# EAGLE design toro10kicker (EAGLE 7.7.0)

## Sheet 1 of 3: Controller
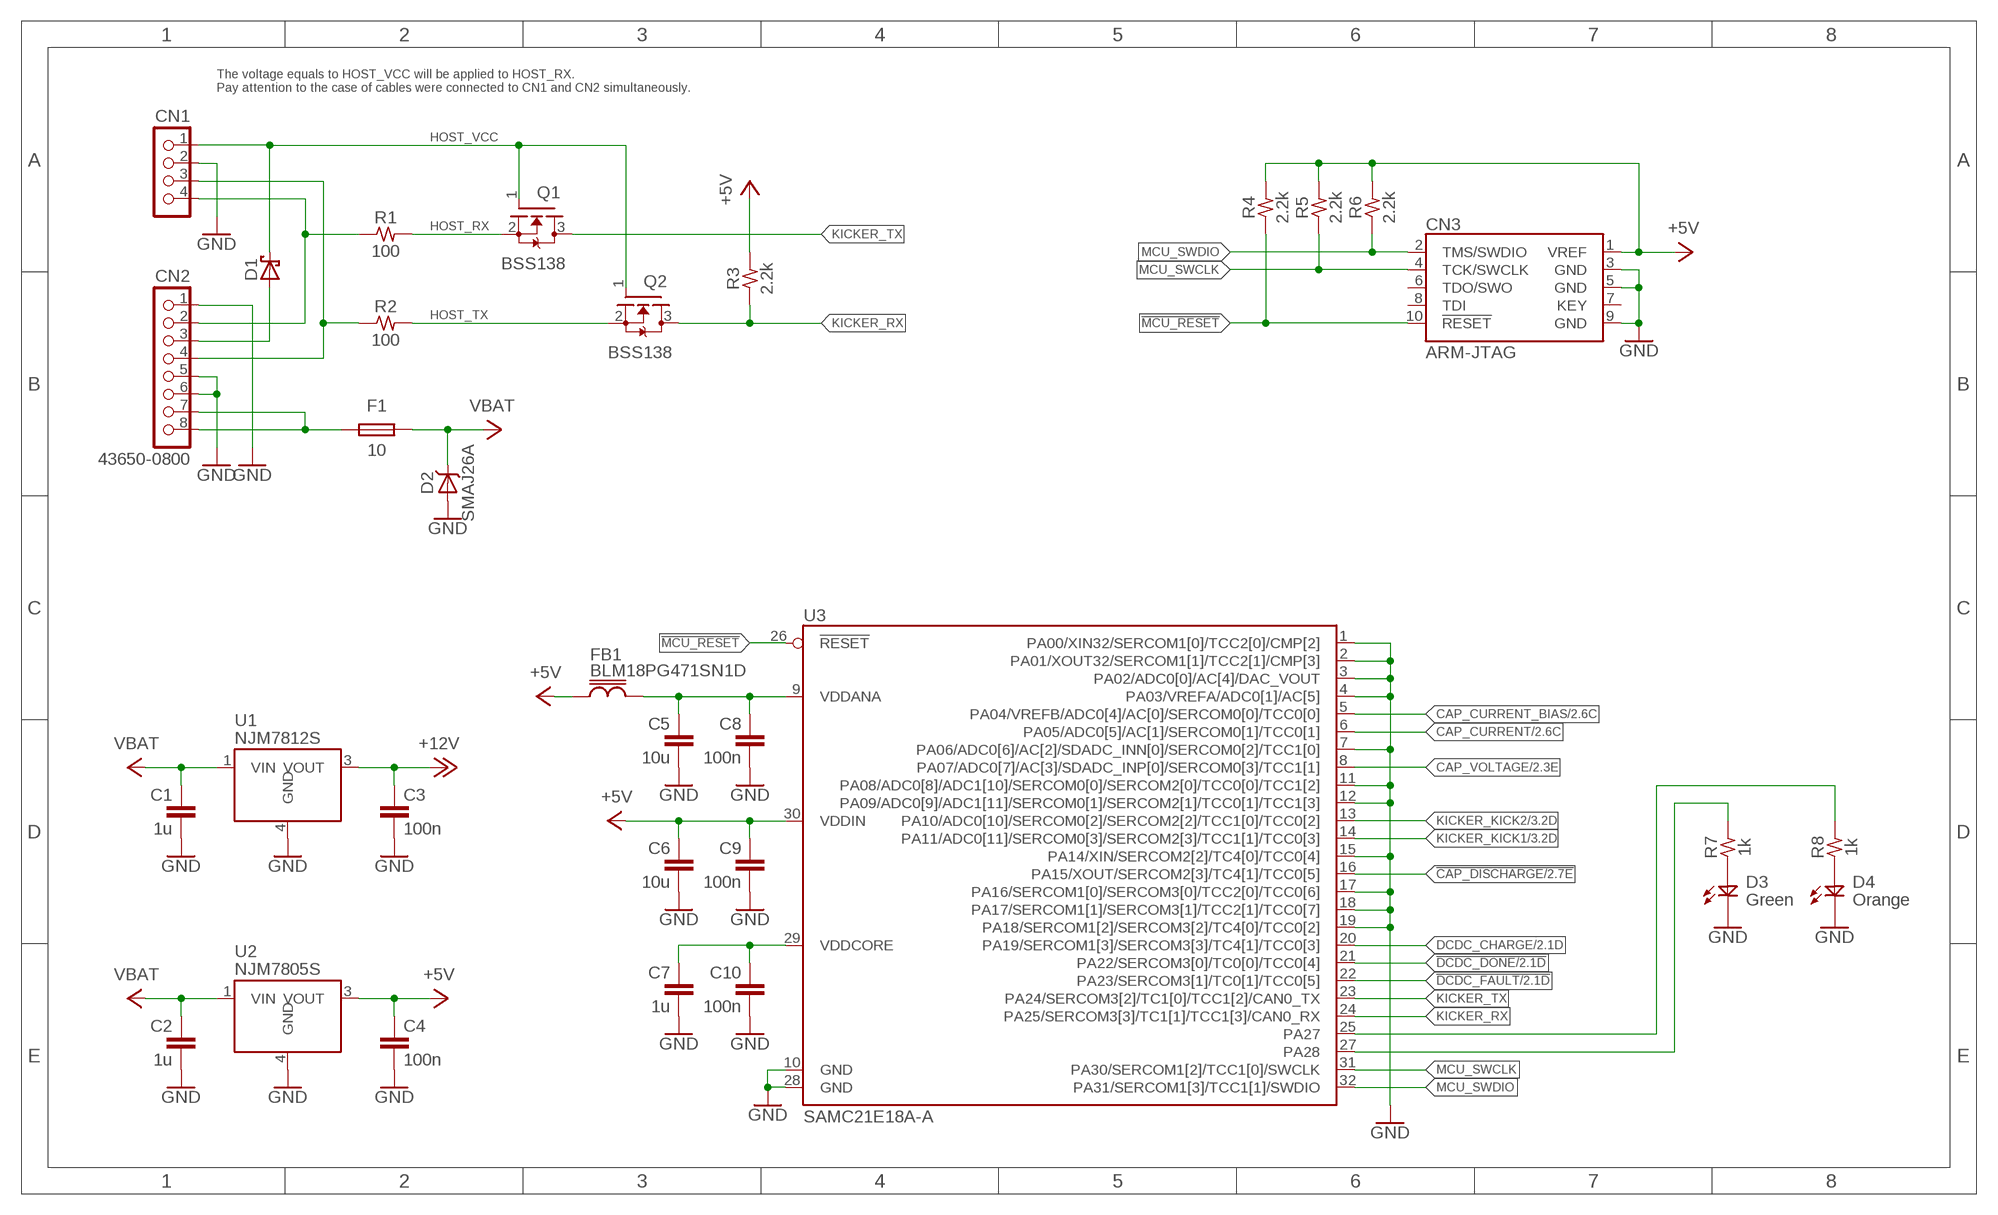
[diagram p0: schematic, sheet 1]

### Parts
C1  1u  C1608  [1608]
C2  1u  C1608  [1608]
C3  100n  C1608  [1608]
C4  100n  C1608  [1608]
C5  10u  C2012  [2012]
C6  10u  C2012  [2012]
C7  1u  C1608  [1608]
C8  100n  C1608  [1608]
C9  100n  C1608  [1608]
C10  100n  C1608  [1608]
CN1  PIN1X4  [PIN1X4]
CN2  43650-0800  [43650-0800]
CN3  ARM-JTAG  [PIN2X5-SMT1.27]
D1  SBD-1608  [1608D]
D2  SMAJ26A  ZENER-DO-214AC  [DO-214AC]
D3  Green  LED1608  [1608D]
D4  Orange  LED1608  [1608D]
F1  10  F3216  [3216]
FB1  BLM18PG471SN1D  FB1608  [1608]
Q1  BSS138  MOS-N-SOT23  [SOT23-3]
Q2  BSS138  MOS-N-SOT23  [SOT23-3]
R1  100  R1608  [1608]
R2  100  R1608  [1608]
R3  2.2k  R1608  [1608]
R4  2.2k  R1608  [1608]
R5  2.2k  R1608  [1608]
R6  2.2k  R1608  [1608]
R7  1k  R1608  [1608]
R8  1k  R1608  [1608]
U1  NJM7812S  [DPAK-3]
U2  NJM7805S  [DPAK-3]
U3  SAMC21E18A-A  [QFP32-0.8]

### Nets
!CAP_DISCHARGE: U3.16(PA15/XOUT/SERCOM2[3]/TC4[1]/TCC0[5]) ; also sheet 2
!DCDC_DONE: U3.21(PA22/SERCOM3[0]/TC0[0]/TCC0[4]) ; also sheet 2
!DCDC_FAULT: U3.22(PA23/SERCOM3[1]/TC0[1]/TCC0[5]) ; also sheet 2
!MCU_RESET: CN3.10(!RESET) R4.1 U3.26(!RESET)
+5V: C4.1 C6.1 C9.1 CN3.1(VREF) FB1.1 R3.2 R4.2 R5.2 R6.2 U2.3(VOUT) U3.30(VDDIN) ; also sheet 2
+12V: C3.1 U1.3(VOUT) ; also sheet 2,3
CAP_CURRENT: U3.6(PA05/ADC0[5]/AC[1]/SERCOM0[1]/TCC0[1]) ; also sheet 2
CAP_CURRENT_BIAS: U3.5(PA04/VREFB/ADC0[4]/AC[0]/SERCOM0[0]/TCC0[0]) ; also sheet 2
CAP_VOLTAGE: U3.8(PA07/ADC0[7]/AC[3]/SDADC_INP[0]/SERCOM0[3]/TCC1[1]) ; also sheet 2
DCDC_CHARGE: U3.20(PA19/SERCOM1[3]/SERCOM3[3]/TC4[1]/TCC0[3]) ; also sheet 2
GND: C1.2 C2.2 C3.2 C4.2 C5.2 C6.2 C7.2 C8.2 C9.2 C10.2 CN1.2 CN2.1 CN2.5 CN2.6 CN3.3(GND) CN3.5(GND) CN3.9(GND) D2.A D3.K D4.K U1.4(GND) U2.4(GND) U3.1(PA00/XIN32/SERCOM1[0]/TCC2[0]/CMP[2]) U3.2(PA01/XOUT32/SERCOM1[1]/TCC2[1]/CMP[3]) U3.3(PA02/ADC0[0]/AC[4]/DAC_VOUT) U3.4(PA03/VREFA/ADC0[1]/AC[5]) U3.7(PA06/ADC0[6]/AC[2]/SDADC_INN[0]/SERCOM0[2]/TCC1[0]) U3.10(GND) U3.11(PA08/ADC0[8]/ADC1[10]/SERCOM0[0]/SERCOM2[0]/TCC0[0]/TCC1[2]) U3.12(PA09/ADC0[9]/ADC1[11]/SERCOM0[1]/SERCOM2[1]/TCC0[1]/TCC1[3]) U3.15(PA14/XIN/SERCOM2[2]/TC4[0]/TCC0[4]) U3.17(PA16/SERCOM1[0]/SERCOM3[0]/TCC2[0]/TCC0[6]) U3.18(PA17/SERCOM1[1]/SERCOM3[1]/TCC2[1]/TCC0[7]) U3.19(PA18/SERCOM1[2]/SERCOM3[2]/TC4[0]/TCC0[2]) U3.28(GND) ; also sheet 2,3
HOST_RX: Q1.2(S) R1.2
HOST_TX: Q2.2(S) R2.2
HOST_VCC: CN1.1 D1.K Q1.1(G) Q2.1(G)
KICKER_KICK1: U3.14(PA11/ADC0[11]/SERCOM0[3]/SERCOM2[3]/TCC1[1]/TCC0[3]) ; also sheet 3
KICKER_KICK2: U3.13(PA10/ADC0[10]/SERCOM0[2]/SERCOM2[2]/TCC1[0]/TCC0[2]) ; also sheet 3
KICKER_RX: Q2.3(D) R3.1 U3.24(PA25/SERCOM3[3]/TC1[1]/TCC1[3]/CAN0_RX)
KICKER_TX: Q1.3(D) U3.23(PA24/SERCOM3[2]/TC1[0]/TCC1[2]/CAN0_TX)
MCU_SWCLK: CN3.4(TCK/SWCLK) R5.1 U3.31(PA30/SERCOM1[2]/TCC1[0]/SWCLK)
MCU_SWDIO: CN3.2(TMS/SWDIO) R6.1 U3.32(PA31/SERCOM1[3]/TCC1[1]/SWDIO)
N$2: CN2.7 CN2.8 F1.1
N$6: C5.1 C8.1 FB1.2 U3.9(VDDANA)
N$7: C7.1 C10.1 U3.29(VDDCORE)
N$17: CN1.4 CN2.2 R1.1
N$34: CN1.3 CN2.4 R2.1
N$35: D3.A R7.1
N$38: CN2.3 D1.A
N$39: D4.A R8.1
N$40: R8.2 U3.25(PA27)
N$41: R7.2 U3.27(PA28)
VBAT: C1.1 C2.1 D2.K F1.2 U1.1(VIN) U2.1(VIN) ; also sheet 2
Unconnected: CN3.6(TDO/SWO) CN3.7(KEY) CN3.8(TDI)

### Notes on the sheet
- The voltage equals to HOST_VCC will be applied to HOST_RX.
  Pay attention to the case of cables were connected to CN1 and CN2 simultaneously.

## Sheet 2 of 3: Charger
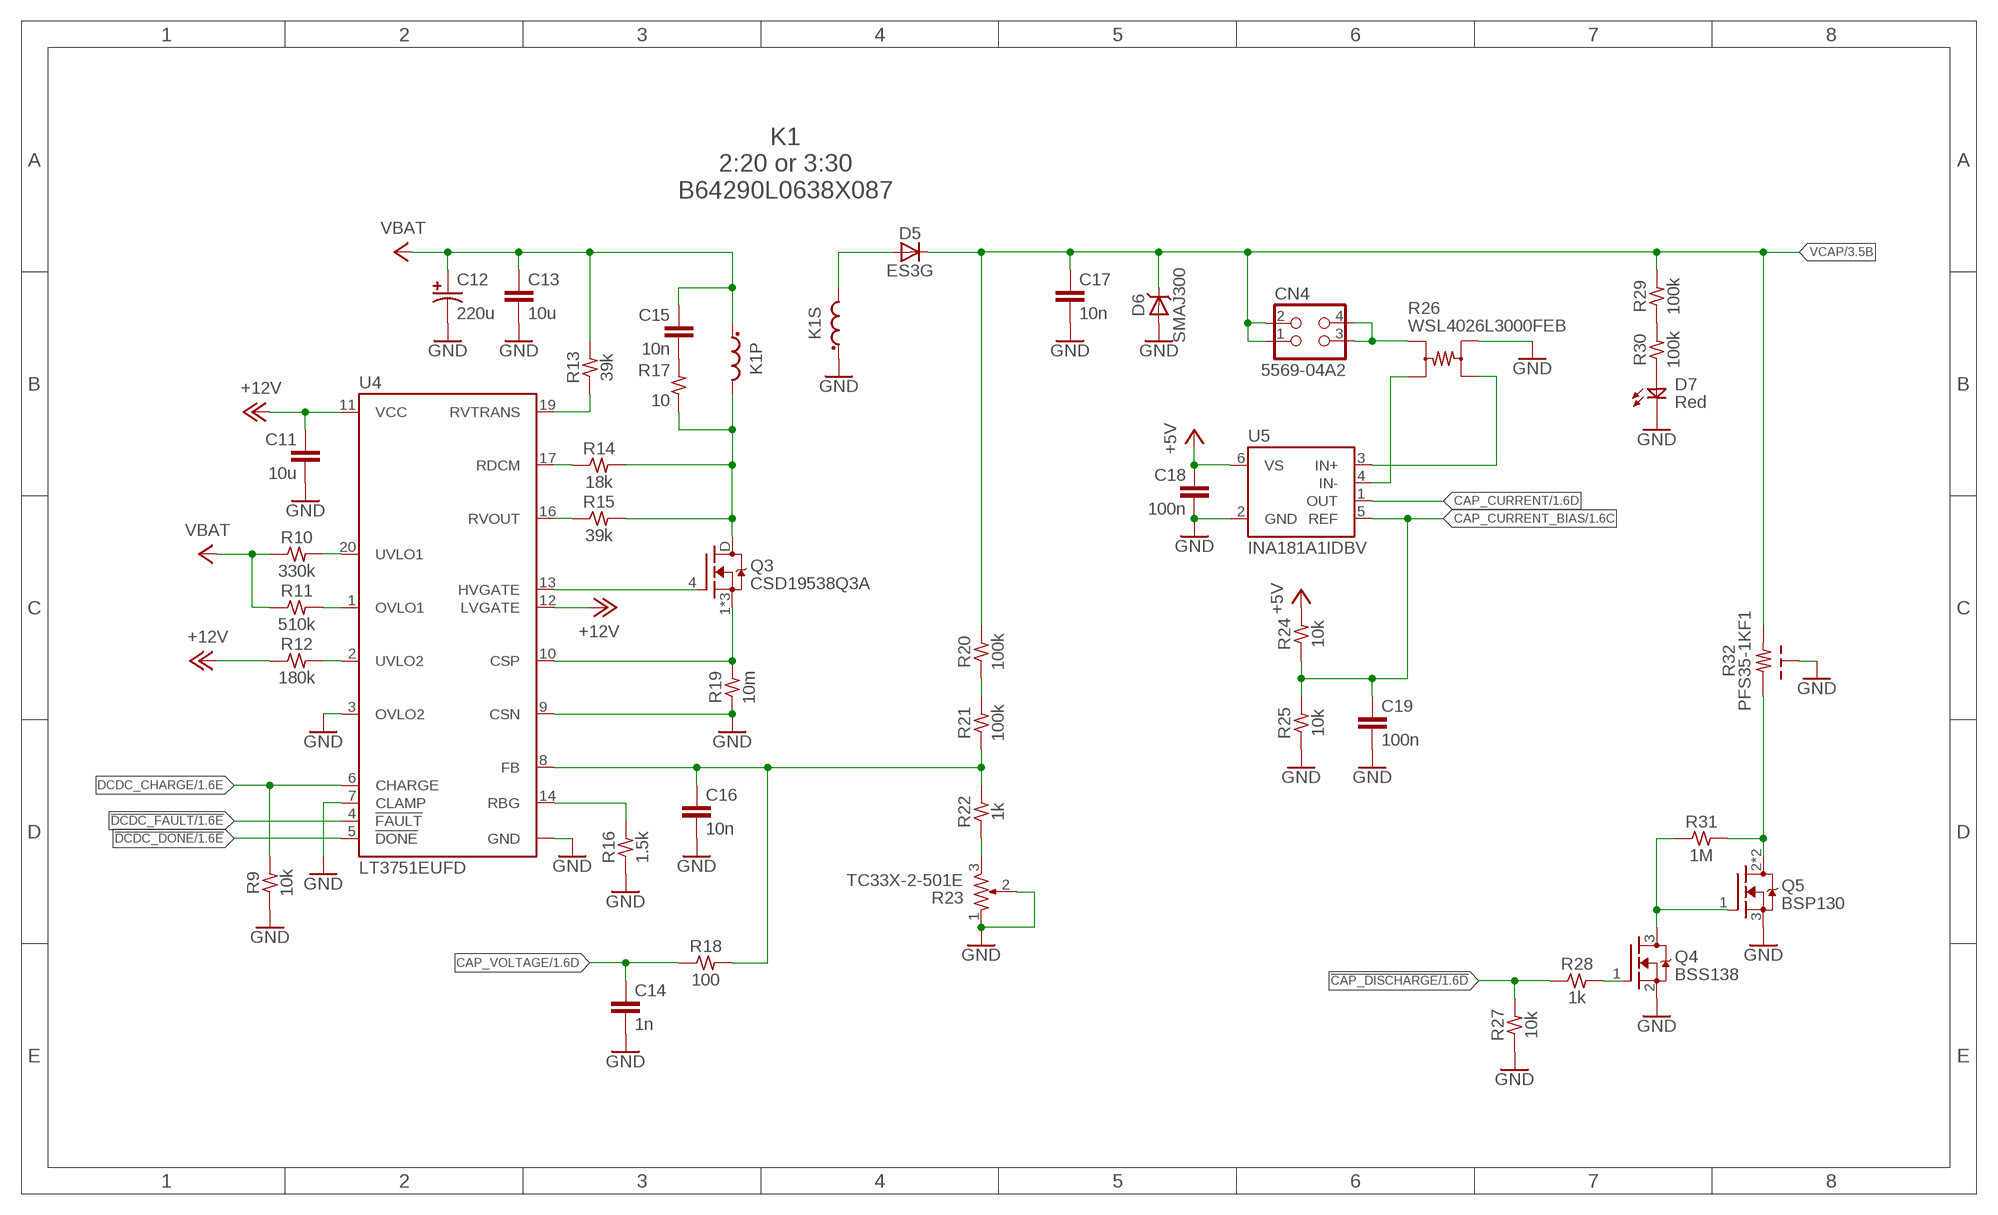
[diagram p1: schematic, sheet 2]

### Parts
C11  10u  C2012  [2012]
C12  220u  CPOL3.5-8  [E3.5-8]
C13  10u  C3225  [3225]
C14  1n  C1608  [1608]
C15  10n  C1608  [1608]
C16  10n  C1608  [1608]
C17  10n  C3225  [3225]
C18  100n  C1608  [1608]
C19  100n  C1608  [1608]
CN4  5569-04A2  [5569-04A2]
D5  ES3G  DIODE-DO-214AB  [DO-214AB]
D6  SMAJ300  ZENER-DO-214AC  [DO-214AC]
D7  Red  LED1608  [1608D]
K1  TRANS  [TRANS-23.3X12.6X7.4]
Q3  CSD19538Q3A  MOS-N-Q3A  [Q3A]
Q4  BSS138  MOS-N-SOT23  [SOT23-3]
Q5  BSP130  MOS-N-SOT223  [SOT223]
R9  10k  R1608  [1608]
R10  330k  R1608  [1608]
R11  510k  R1608  [1608]
R12  180k  R1608  [1608]
R13  39k  R1608  [1608]
R14  18k  R1608  [1608]
R15  39k  R1608  [1608]
R16  1.5k  R1608  [1608]
R17  10  R3216  [3216]
R18  100  R1608  [1608]
R19  10m  R3216  [3216]
R20  100k  R3216  [3216]
R21  100k  R3216  [3216]
R22  1k  R1608  [1608]
R23  TC33X-2-501E  VR-TC33X  [TC33X]
R24  10k  R1608  [1608]
R25  10k  R1608  [1608]
R26  WSL4026L3000FEB  WSL4026  [WSL4026]
R27  10k  R1608  [1608]
R28  1k  R1608  [1608]
R29  100k  R3216  [3216]
R30  100k  R3216  [3216]
R31  1M  R3216  [3216]
R32  PFS35-1KF1  PFS35  [D2PAK-3]
U4  LT3751EUFD  [QFN20-0.5-4X5]
U5  INA181A1IDBV  [SOT23-6]

### Nets
!CAP_DISCHARGE: R27.2 R28.1 ; also sheet 1
!DCDC_DONE: U4.5(!DONE) ; also sheet 1
!DCDC_FAULT: U4.4(!FAULT) ; also sheet 1
+5V: C18.1 R24.2 U5.6(VS) ; also sheet 1
+12V: C11.1 R12.1 U4.11(VCC) U4.12(LVGATE) ; also sheet 1,3
CAP_CURRENT: U5.1(OUT) ; also sheet 1
CAP_CURRENT_BIAS: C19.1 R24.1 R25.2 U5.5(REF) ; also sheet 1
CAP_VOLTAGE: C14.1 R18.1 ; also sheet 1
DCDC_CHARGE: R9.2 U4.6(CHARGE) ; also sheet 1
GND: C11.2 C12.N C13.2 C14.2 C16.2 C17.2 C18.2 C19.2 D6.A D7.K K1.2A Q4.2(S) Q5.3(S) R9.1 R16.1 R19.1 R23.1(A) R23.2(W) R25.1 R26.1A R27.1 R32.4(S) U4.3(OVLO2) U4.7(CLAMP) U4.9(CSN) U4.PAD(GND) U5.2(GND) ; also sheet 1,3
N$1: Q3.1(S) Q3.2(S) Q3.3(S) R19.2 U4.10(CSP)
N$3: R10.2 U4.20(UVLO1)
N$4: R11.2 U4.1(OVLO1)
N$5: R12.2 U4.2(UVLO2)
N$8: Q5.2(D) Q5.4(D) R31.2 R32.1
N$9: R14.1 U4.17(RDCM)
N$10: R15.1 U4.16(RVOUT)
N$11: K1.1B Q3.D R14.2 R15.2 R17.1
N$12: R13.1 U4.19(RVTRANS)
N$13: Q3.4(G) U4.13(HVGATE)
N$14: R22.1 R23.3(B)
N$15: C16.1 R18.2 R21.1 R22.2 U4.8(FB)
N$16: R16.2 U4.14(RBG)
N$19: CN4.3 CN4.4 R26.2A
N$21: R29.1 R30.2
N$22: D5.A K1.2B
N$29: R20.1 R21.2
N$30: Q4.3(D) Q5.1(G) R31.1
N$31: C15.2 R17.2
N$32: Q4.1(G) R28.2
N$33: D7.A R30.1
N$36: R26.2B U5.4(IN-)
N$37: R26.1B U5.3(IN+)
VBAT: C12.P C13.1 C15.1 K1.1A R10.1 R11.1 R13.2 ; also sheet 1
VCAP: C17.1 CN4.1 CN4.2 D5.K D6.K R20.2 R29.2 R32.3 ; also sheet 3

### Notes on the sheet
- K1
  2:20 or 3:30
  B64290L0638X087

## Sheet 3 of 3: Driver
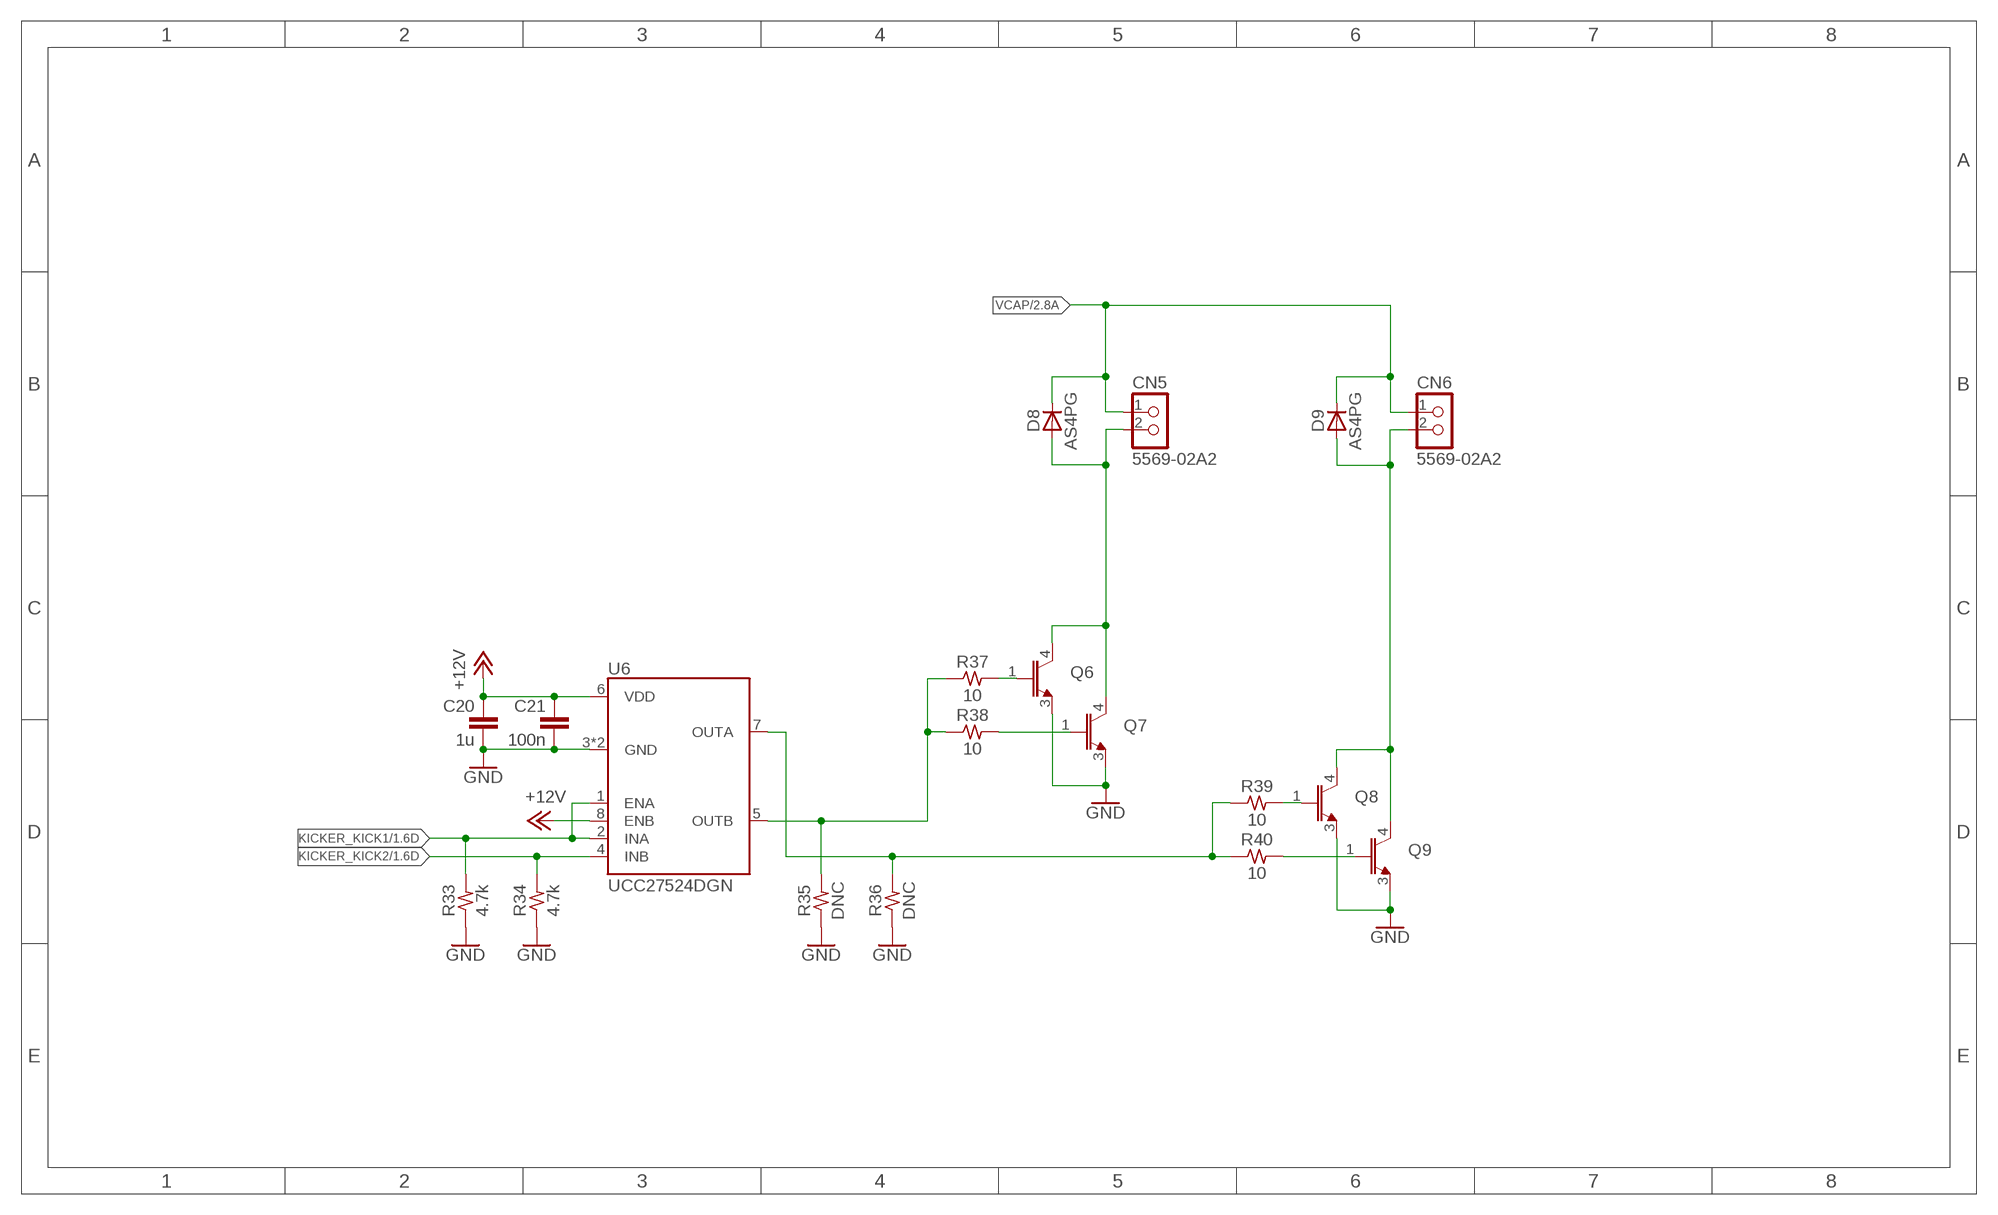
[diagram p2: schematic, sheet 3]

### Parts
C20  1u  C1608  [1608]
C21  100n  C1608  [1608]
CN5  5569-02A2  [5569-02A2]
CN6  5569-02A2  [5569-02A2]
D8  AS4PG  DIODE-SMPC  [SMPC]
D9  AS4PG  DIODE-SMPC  [SMPC]
Q6  IGBT-N-D2PAK  [D2PAK-3]
Q7  IGBT-N-D2PAK  [D2PAK-3]
Q8  IGBT-N-D2PAK  [D2PAK-3]
Q9  IGBT-N-D2PAK  [D2PAK-3]
R33  4.7k  R1608  [1608]
R34  4.7k  R1608  [1608]
R35  DNC  R1608  [1608]
R36  DNC  R1608  [1608]
R37  10  R2012  [2012]
R38  10  R2012  [2012]
R39  10  R2012  [2012]
R40  10  R2012  [2012]
U6  UCC27524DGN  [MSOP8-PAD]

### Nets
+12V: C20.1 C21.1 U6.6(VDD) U6.8(ENB) ; also sheet 1,2
GND: C20.2 C21.2 Q6.3(E) Q7.3(E) Q8.3(E) Q9.3(E) R33.1 R34.1 R35.1 R36.1 U6.3(GND) U6.PAD(GND) ; also sheet 1,2
KICKER_KICK1: R33.2 U6.1(ENA) U6.2(INA) ; also sheet 1
KICKER_KICK2: R34.2 U6.4(INB) ; also sheet 1
N$18: CN5.2 D8.1(A) D8.2(A) Q6.4(C) Q7.4(C)
N$20: CN6.2 D9.1(A) D9.2(A) Q8.4(C) Q9.4(C)
N$23: Q6.1(G) R37.2
N$24: Q7.1(G) R38.2
N$25: R35.2 R37.1 R38.1 U6.5(OUTB)
N$26: Q8.1(G) R39.2
N$27: Q9.1(G) R40.2
N$28: R36.2 R39.1 R40.1 U6.7(OUTA)
VCAP: CN5.1 CN6.1 D8.K D9.K ; also sheet 2

## Library data of the parts
C1-C11 C13-C21 = kiks-passive:C
C12 = kiks-passive:CPOL
CN1 = kiks-connector:PIN1X4
CN2 = kiks-connector:43650-0800
CN3 = kiks-connector:ARM-JTAG
CN4 = kiks-connector:5569-04A2
CN5 CN6 = kiks-connector:5569-02A2
D1 = kiks-discrete:SBD-?
D2 D6 = kiks-discrete:ZENER-?
D3 D4 D7 = kiks-discrete:LED
D5 D8 D9 = kiks-discrete:DIODE-?
F1 = kiks-passive:F
FB1 = kiks-passive:FB
K1 = kiks-passive:TRANS
Q1-Q5 = kiks-discrete:MOS-N-?
Q6-Q9 = kiks-discrete:IGBT-N-?
R1-R22 R24 R25 R27-R31 R33-R40 = kiks-passive:R
R23 = kiks-passive:VR-?
R26 = kiks-passive:WSL4026
R32 = kiks-passive:PFS35
U1 U2 = kiks-ic:NJM78*S
U3 = kiks-ic:SAMC21E*A-?; FLASH: 256KB
U4 = kiks-ic:LT3751*?
U5 = kiks-ic:INA181*I?; GAIN: 20
U6 = kiks-ic:UCC27524

## Board
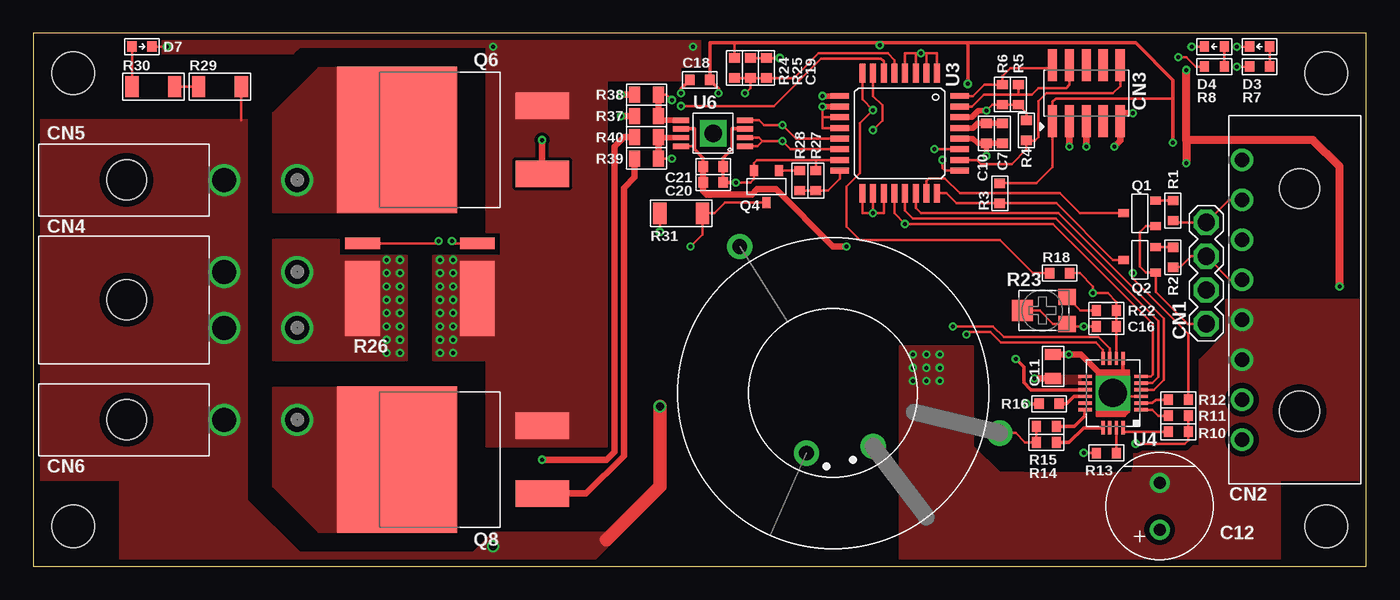
[diagram p3: board, top side]
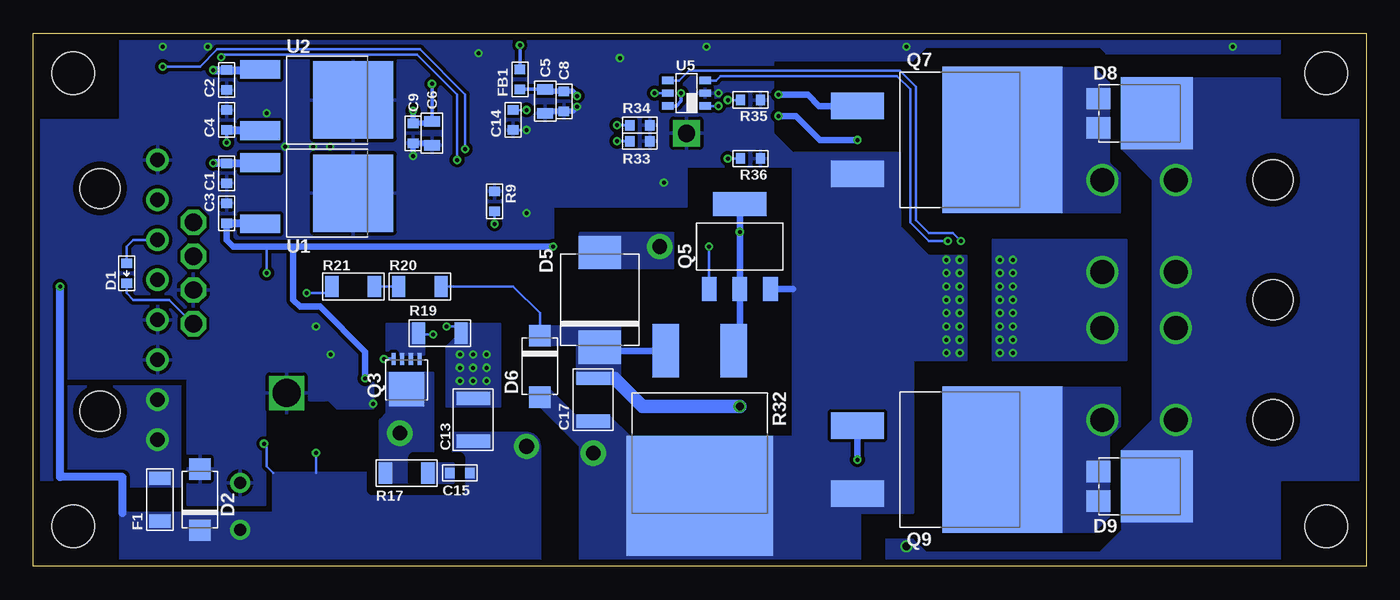
[diagram p4: board, bottom side, seen from below]

Size 100 x 40 mm. Coordinates in mm from the lower left corner, seen from the top.
Outline: 0,0 100,0 100,40 0,40 0,0
Copper layers (1*16): Top 0.07mm / dielectric 1.6mm / Bottom 0.07mm
Design rules "Elecrow_2-layer_PCB_eagle_rule *": minimum track width 6mil, minimum drill 0.3mm, track to track 6mil, track to pad 6mil, pad to pad 6mil, via to via 6mil, smd to smd 0mil, copper to edge 20mil, drill to drill 10mil, minimum pad ring 6mil, minimum via ring 6mil, stop-mask expansion 2mil, vias tented up to drill 0.6mm, thermal gap 10mil
Holes 3.2 mm at 3,3 3,37 97,37 97,3
tRestrict: 6 lines
bRestrict: 32 lines

### Footprints (pad centres in the part's own frame; a part is rotated, then mirrored left to right if it is on the bottom)
1608 = smd 0.7 x 0.8: 1 -0.75,0; 2 0.75,0
2012 = smd 0.8 x 1.2: 1 -0.9,0; 2 0.9,0
E3.5-8 = drill 0.9 pad 1.5: N 1.75,0; P -1.75,0
3225 = smd 1 x 2.5: 1 -1.6,0; 2 1.6,0
PIN1X4 = drill 1.3 pad 1.9 octagon: 1 -3.81,0; 2 -1.27,0; 3 1.27,0; 4 3.81,0
43650-0800 = drill 1.1 pad 1.7: 1 -10.5,-4.32; 2 -7.5,-4.32; 3 -4.5,-4.32; 4 -1.5,-4.32; 5 1.5,-4.32; 6 4.5,-4.32; 7 7.5,-4.32; 8 10.5,-4.32 | hole 3: 8.35,0; -8.35,0
PIN2X5-SMT1.27 = smd 0.7 x 2.4: 1 -2.54,-2.1; 2 -2.54,2.1; 3 -1.27,-2.1; 4 -1.27,2.1; 5 0,-2.1; 6 0,2.1; 7 1.27,-2.1; 8 1.27,2.1; 9 2.54,-2.1; 10 2.54,2.1
5569-04A2 = drill 1.8 pad 2.4: 1 -2.1,-7.3; 2 2.1,-7.3; 3 -2.1,-12.8; 4 2.1,-12.8 | hole 3: 0,0
5569-02A2 = drill 1.8 pad 2.4: 1 0,-7.3; 2 0,-12.8 | hole 3: 0,0
1608D = smd 0.7 x 0.8: A 0.75,0; K -0.75,0
DO-214AC = smd 1.6 x 1.6: A 2.3,0; K -2.3,0
DO-214AB = smd 2.5 x 3.2: A 3.55,0; K -3.55,0
SMPC = smd 1.6 x 1.8: 1 1.1,-3.1; 2 -1.1,-3.1 | smd 5.4 x 5.4: K 0,1.3
3216 = smd 1 x 1.6: 1 -1.6,0; 2 1.6,0
TRANS-23.3X12.6X7.4 = drill 1.1 pad 1.9: 1A -3,4; 1B -12.5,3; 2A 2,4.5; 2B 7,-11
SOT23-3 = smd 0.6 x 0.8: 1 -0.95,-1.2; 2 0.95,-1.2; 3 0,1.2
Q3A = smd 0.9 x 0.32: 1 -1.55,0.975; 2 -1.55,0.325; 3 -1.55,-0.325; 4 -1.55,-0.975 | smd 2.58 x 2.65: D 0.71,0
SOT223 = smd 1.1 x 1.8: 1 -2.3,-3.2; 2 0,-3.2; 3 2.3,-3.2 | smd 4 x 1.8: 4 0,3.2
D2PAK-3 = smd 2 x 4: 1 -2.54,-3.175; 3 2.54,-3.175 | smd 11 x 9: 4 0,7.7
TC33X = smd 1.2 x 1.3: 1 -1,-1.85; 3 1,-1.85 | smd 1.6 x 1.6: 2 0,1.5
WSL4026 = smd 2.6 x 5.6: 1A -4.3,0.9; 2A 4.3,0.9 | smd 2.6 x 0.89: 1B -4.3,-3.235; 2B 4.3,-3.235
DPAK-3 = smd 1.4 x 3: 1 -2.3,-2; 3 2.3,-2 | smd 5.8 x 6: 4 0,5
QFP32-0.8 = smd 1.4 x 0.45: 1 -4.5,2.8; 2 -4.5,2; 3 -4.5,1.2; 4 -4.5,0.4; 5 -4.5,-0.4; 6 -4.5,-1.2; 7 -4.5,-2; 8 -4.5,-2.8; 17 4.5,-2.8; 18 4.5,-2; 19 4.5,-1.2; 20 4.5,-0.4; 21 4.5,0.4; 22 4.5,1.2; 23 4.5,2; 24 4.5,2.8 | smd 0.45 x 1.4: 9 -2.8,-4.5; 10 -2,-4.5; 11 -1.2,-4.5; 12 -0.4,-4.5; 13 0.4,-4.5; 14 1.2,-4.5; 15 2,-4.5; 16 2.8,-4.5; 25 2.8,4.5; 26 2,4.5; 27 1.2,4.5; 28 0.4,4.5; 29 -0.4,4.5; 30 -1.2,4.5; 31 -2,4.5; 32 -2.8,4.5
QFN20-0.5-4X5 = smd 1 x 0.25: 1 -2.1,1.25; 2 -2.1,0.75; 3 -2.1,0.25; 4 -2.1,-0.25; 5 -2.1,-0.75; 6 -2.1,-1.25; 11 2.1,-1.25; 12 2.1,-0.75; 13 2.1,-0.25; 14 2.1,0.25; 15 2.1,0.75; 16 2.1,1.25 | smd 0.25 x 1: 7 -0.75,-2.6; 8 -0.25,-2.6; 9 0.25,-2.6; 10 0.75,-2.6; 17 0.75,2.6; 18 0.25,2.6; 19 -0.25,2.6; 20 -0.75,2.6 | drill 2.1 pad 2.6 square: PAD 0,0
SOT23-6 = smd 0.55 x 0.85: 1 -0.95,-1.4; 2 0,-1.4; 3 0.95,-1.4; 4 0.95,1.4; 5 0,1.4; 6 -0.95,1.4
MSOP8-PAD = smd 0.4 x 1.2: 1 -0.975,-2.4; 2 -0.325,-2.4; 3 0.325,-2.4; 4 0.975,-2.4; 5 0.975,2.4; 6 0.325,2.4; 7 -0.325,2.4; 8 -0.975,2.4 | drill 1.3 pad 2 square: PAD 0,0

### Placement (x,y rotation side)
C1  85.5,29.5 270 bottom
C2  85.5,36.5 270 bottom
C3  85.5,26.5 90 bottom
C4  85.5,33.5 90 bottom
C5  61.6,34.9 270 bottom
C6  70.1,32.5 270 bottom
C7  72.7,32.5 270 top
C8  60.2,34.9 270 bottom
C9  71.5,32.5 270 bottom
C10  71.5,32.5 270 top
C11  76.5,15 90 top
C12  84.5,4.5 90 top
C13  67,11 90 bottom
C14  64,33.5 270 bottom
C15  68,7 180 bottom
C16  80.5,18 180 top
C17  58,12.5 270 bottom
C18  50,36.5 180 top
C19  55,37.4 90 top
C20  51,28.8 0 top
C21  51,30 0 top
CN1  88,22 90 top
CN2  95,20 270 top
CN3  79,35.5 0 top
CN4  7,20 90 top
CN5  7,29 90 top
CN6  7,11 90 top
D1  93,22 90 bottom
D2  87.5,5 90 bottom
D3  92,39 0 top
D4  88.6,39 0 top
D5  57.5,20 90 bottom
D6  62,15 270 bottom
D7  8.15,39 180 top
D8  17,34 270 bottom
D9  17,6 270 bottom
F1  90.5,5 270 bottom
FB1  63.5,36.55 270 bottom
K1  60,13 180 top
Q1  83,26.5 90 top
Q2  83,23 90 top
Q3  72,14 270 bottom
Q4  55,28.5 180 top
Q5  47,24 0 bottom
Q6  35,32 90 top
Q7  35,32 270 bottom
Q8  35,8 90 top
Q9  35,8 270 bottom
R1  85.5,26.7 90 top
R2  85.5,23.2 90 top
R3  72.5,28 90 top
R4  74.5,32.7 90 top
R5  73.9,35.4 270 top
R6  72.7,35.4 270 top
R7  92,37.5 180 top
R8  88.6,37.5 180 top
R9  65.4,27.4 270 bottom
R10  85.9,10.1 180 top
R11  85.9,11.3 180 top
R12  85.9,12.5 180 top
R13  80.5,8.5 180 top
R14  76,9.3 180 top
R15  76,10.5 180 top
R16  76.2,12.2 0 top
R17  72,7 0 bottom
R18  77,22 0 top
R19  69.5,17.5 180 bottom
R20  71,21 0 bottom
R21  76,21 0 bottom
R22  80.5,19.2 0 top
R23  75.7,19.2 90 top
R24  52.6,37.4 90 top
R25  53.8,37.4 270 top
R26  29,21 180 top
R27  58.7,28.95 270 top
R28  57.5,28.95 90 top
R29  14,36 0 top
R30  9,36 0 top
R31  48.6,26.5 180 top
R32  50,13 180 bottom
R33  54.5,31.9 180 bottom
R34  54.5,33.1 180 bottom
R35  46.2,35 180 bottom
R36  46.2,30.6 180 bottom
R37  46,33.8 180 top
R38  46,35.4 180 top
R39  46,30.6 180 top
R40  46,32.2 180 top
U1  81,28 270 bottom
U2  81,35 270 bottom
U3  65,32.5 270 top
U4  81,13 180 top
U5  51,35.5 90 bottom
U6  51,32.5 90 top

### Tracks (layer width: path | path; a pad name or v marks a point on that pad's centre or on a via)
!CAP_DISCHARGE
  Top 0.2: R28.1 R27.2 59.6,28.2 60.5,29.1 U3.16
!DCDC_DONE
  Top 0.2: U4.5 83.95,13.75 84.4,14.2 84.4,18.4 76.7,26.1 66,26.1 65.4,26.7 U3.21
!DCDC_FAULT
  Top 0.2: U4.4 84.05,13.25 84.8,14 84.8,18.6 76.9,26.5 66.6,26.5 66.2,26.9 U3.22
!MCU_RESET
  Top 0.2: U3.26 70.8,30.5 71.1,30.2 73.4,30.2 74.5,31.3 R4.1 75.15,31.95 75.4,32.2 75.4,34.9 76,35.5 81,35.5 81.54,36.04 CN3.10
+5V  (via drill 0.3)
  Top 0.2: v71.5,34.2 71.95,34.65 R6.2 R5.2 74.5,34.05 R4.2 | R3.2 75.25,28.75 76.46,29.96 CN3.1 76.46,34.86 76.7,35.1 85.5,35.1 | R24.2 52.6,39.3
  Top 0.25: v51.4,35.5 51.4,35.85 C18.1 50.75,39.3 52.6,39.3 63.5,39.3 | v63.5,39.1 63.5,39.3 | 63.5,39.3 70.1,39.3 | 70.1,39.3 82.7,39.3 85.5,36.5 85.5,35.1 v85.5,31.8 | v70.1,36.2 70.1,39.3
  Top 0.4: U3.30 70.4,33.7 70.9,34.2 v71.5,34.2
  Bottom 0.25: U5.6 51.75,34.55 51.4,34.9 v51.4,35.5 | C4.1 v85.5,31.8 | v70.1,36.2 C6.1 | FB1.1 v63.5,39.1
  Bottom 0.4: v71.5,34.2 C9.1 70.25,33.25 C6.1
  Bottom 0.6: C4.1 83.05,32.75 U2.3
+12V  (via drill 0.3)
  Top 0.2: U6.8 49.6,31.52 | R12.1 86.65,17.45 82.5,21.6 v82.5,22
  Top 0.25: U6.6 49.6,32.83 49.6,31.52 49.6,31.3 50.25,30.65 C21.1
  Top 0.5: v75.1,14.1 C11.1 | v61,24 60,24 55.7,28.3 54.3,28.3 53.9,27.9 50.5,27.9 50.25,28.15 C20.1 C21.1
  Bottom 0.2: v82.5,22 82.5,24
  Bottom 0.5: v75.1,14.1 75.1,16.1 78.5,19.5 80,19.5 80.5,20 80.5,24 | C3.1 85.5,24.5 85,24 82.5,24 80.5,24 | 80.5,24 v61,24
  Bottom 0.6: C3.1 83.05,25.75 U1.3
  pour Top (isolate 0.25, no thermals): 76.05,14.25 78.5,14.25 78.5,13.75 76.05,13.75
CAP_CURRENT  (via drill 0.3)
  Top 0.2: v48.6,34.55 55.55,34.55 59.1,38.1 63.6,38.1 63.8,37.9 U3.6
  Bottom 0.2: U5.1 v48.6,34.55
CAP_CURRENT_BIAS  (via drill 0.3)
  Top 0.2: R25.2 53.8,35.9 v53.4,35.5 | R24.1 R25.2 | R25.2 C19.1 57.05,36.65 58.9,38.5 64.1,38.5 64.6,38 U3.5
  Bottom 0.2: U5.5 v53.4,35.5
CAP_VOLTAGE  (via drill 0.3)
  Top 0.2: U3.8 62.2,35.05 v63,34.25 62,33.25 62,29.5 61,28.5 61,25.5 62,24.5 72.5,24.5 75,22 R18.1
  Bottom 0.2: C14.1 v63,34.25
DCDC_CHARGE  (via drill 0.3)
  Top 0.2: U4.6 83.85,14.25 84,14.4 84,18.2 76.5,25.7 v65.4,25.7 64.6,26.5 U3.20
  Bottom 0.2: R9.2 v65.4,25.7
GND  (via drill 0.3)
  Top 0.2: U4.9 80.75,16.35 79.9,17.2 72.8,17.2 72,18 v69,18 | C16.2 v78.8,18 77.75,18 R23.1 76.5,18.2 75.5,19.2 R23.2 | U4.3 81.25,12.75 U4.PAD | R27.1 58.7,30.5 | 58.7,30.5 54.3,30.5 54.05,30.25 Q4.2 54.05,29.05 53.8,28.8 v52.7,28.8 | R25.1 C19.2 v56,38.15 | U3.7 63,35.3 63.7,34.6 63.7,33.45 v63,32.75 | D3.K v90.3,39 | D4.K v86.9,39 | D7.K v10,39 | U3.4 65.4,38.5 66.2,38.5 | 66.2,38.5 v66.6,38.5 67,38.5 | 67,38.5 67.8,38.5 U3.1 | U3.2 67,38.5 | U3.3 66.2,38.5 | U3.11 59.2,33.7 | 59.2,33.7 v59.2,34.5 | U3.12 59.2,32.9 59.2,33.7 | U3.15 58.7,30.5 | U3.17 62.2,26.5 v63,26.5 | v63,26.5 U3.18 | U3.19 63.8,26.5 v63,26.5
  Top 0.25: R16.1 v74.5,12.2 | U4.7 81.75,13.75 U4.PAD | U6.3 52.4,32.83 52.4,31.3 51.75,30.65 C21.2 C20.2 v52.7,28.8 | v48.6,35.5 48.6,35.85 C18.2
  Top 0.4: U3.28 70.5,32.1 70.85,31.75 C10.2 | C7.2 C10.2 | C10.2 v71.5,30.8 | U3.10 v59.2,34.5
  Top 0.5: C11.2 v77.7,15.9 78.6,15.9 81,13.5 U4.PAD | CN3.3 v77.73,31.5 | CN3.5 v79,31.5 | 82.04,34 v82.5,34 81.54,34 CN3.9 81.54,31.94 v81.1,31.5
  Bottom 0.2: v69,18 68.4,18 R19.1 | C14.2 v63,32.75
  Bottom 0.4: v71.5,30.8 C10.2 70.25,31.75 C6.2 | v59.2,34.5 59.55,34.15 C8.2 61.45,34.15 C5.2
  Bottom 0.5: Q5.3 43,20.8
  other vias: 66,13.9 67,13.9 68,13.9 68,14.9 67,14.9 66,14.9 66,15.9 67,15.9 68,15.9 30.5,23 31.5,23 31.5,22 30.5,22 30.5,21 31.5,21 31.5,20 30.5,20 30.5,19 31.5,19 30.5,18 31.5,18 30.5,17 31.5,17 30.5,16 31.5,16 49.5,39 34.5,39
  pour Bottom (isolate 0.25, rank 2, no thermals): 65,12 65,18.2 68.3,18.2 68.3,17.2 69,16.5 69,12
  pour Top (isolate 0.4, no thermals): 65,16.5 70.5,16.5 70.5,9 72.5,7 82.5,7 82.5,9 87.5,9 87.5,15.5 89.5,17.5 89.5,20 99.5,20 99.5,6.5 93.5,6.5 93.5,0.5 65,0.5
  pour Top (isolate 0.25, rank 2, no thermals): 30,15.5 34,15.5 34,9 43,9 43,36.5 48.5,36.5 48.5,37.5 50,37.5 50,41 9.7,41 9.7,38.5 19.5,38.5 20,39 34,39 34,25.1 35.1,25.1 35.1,23.3 30,23.3
  pour Bottom (isolate 0.25, no thermals): 30,23.3 30,15.5 34,15.5 34,4 38,4 38,-1 59,-1 59,9 62.3,12.3 62.3,13.4 61.4,13.4 59.3,11.3 56.8,11.3 55.2,9.7 43,9.7 43,31 35,31 35,25.5 32.8,23.3
  pour Bottom (isolate 0.25, rank 6): 6.5,41 6.5,38.5 19.5,38.5 20,39 33,39 34,38 44.5,38 44.5,32.5 43,31 43,30 51,30 51,27 61,27 61,24.5 74.5,24.5 74.5,11.5 82.6,11.5 82.6,4.6 88.4,4.6 88.4,14.1 98,14.1 98,6.5 101,6.5 101,33.5 93.5,33.5 93.5,41
HOST_RX
  Top 0.2: Q1.2 R1.2
HOST_TX
  Top 0.2: R2.2 Q2.2
HOST_VCC
  Top 0.2: Q1.1 83.45,25.55 83,25.1 83,22.5 83.45,22.05 Q2.1 84.2,20.6 86.61,18.19 CN1.1
  Bottom 0.2: D1.K 93,20.5 92.5,20 89.81,20 CN1.1
KICKER_KICK1  (via drill 0.3)
  Top 0.2: U6.2 54.42,32.17 54.7,31.9 | 54.7,31.9 v56.2,31.9 56.8,31.3 U3.14 | U6.1 54.33,31.52 54.7,31.9
  Bottom 0.2: R33.2 v56.2,31.9
KICKER_KICK2  (via drill 0.3)
  Top 0.2: U6.4 54.42,33.48 54.8,33.1 v56.2,33.1 57.2,32.1 U3.13
  Bottom 0.2: R34.2 v56.2,33.1
KICKER_RX
  Top 0.2: Q2.3 81,23 76.75,27.25 R3.1 69.25,27.25 68.5,28 U3.24
KICKER_TX
  Top 0.2: Q1.3 78.5,26.5 77,28 69.5,28 68.4,29.1 67.2,29.1 67,28.9 U3.23
MCU_SWCLK
  Top 0.2: U3.31 70.4,34.5 71.3,35.4 73.9,35.4 | CN3.4 77.73,36.13 77.5,35.9 75.4,35.9 74.9,35.4 73.9,35.4 | R5.1 73.9,35.4
MCU_SWDIO
  Top 0.2: U3.32 70.5,35.3 71.35,36.15 R6.1 72.7,36.8 73.3,37.4 76.46,37.4 CN3.2
N$1  (via drill 0.3)
  Top 0.2: U4.10 80.25,16.25 79.7,16.8 72.6,16.8 71.8,17.6 70.2,17.6 v70,17.4
  Bottom 0.2: R19.2 71,17.4 v70,17.4
  pour Bottom (isolate 0.25, no thermals): 73.5,15.9 73.5,18.2 70.7,18.2 70.7,15.9
N$2
  pour Bottom (isolate 0.25, no thermals): 89,13.5 89,6 93.5,6 93.5,6.5 97.5,6.5 97.5,13.5
N$3
  Top 0.2: R10.2 81.75,10.1 U4.20
N$4
  Top 0.2: R11.2 84.4,11.3 83.95,11.75 U4.1
N$5
  Top 0.2: R12.2 84.2,12.5 83.95,12.25 U4.2
N$6  (via drill 0.3)
  Top 0.4: U3.9 v59.2,35.3
  Bottom 0.25: C5.1 FB1.2
  Bottom 0.4: v59.2,35.3 59.55,35.65 C8.1 61.45,35.65 C5.1
N$7
  Top 0.4: C7.1 C10.1 70.85,33.25 70.5,32.9 U3.29
N$8  (via drill 0.3)
  Top 0.2: R31.2 v47,25.1
  Bottom 0.5: R32.1 47,16.64 Q5.2 v47,25.1 Q5.4
N$9
  Top 0.25: U4.17 78.8,10.4 77.7,9.3 R14.1
N$10
  Top 0.25: U4.16 78.9,11.3 78.1,10.5 R15.1
N$11
  Top 0.2: R15.2 R14.2 74.4,9.3 73.7,10 K1.1B
  pour Bottom (isolate 0.25, rank 2, no thermals): 70,14.5 70,6.3 74,6.3 74,11 73.5,11.5 73.5,14.5
N$12
  Top 0.2: U4.19 R13.1
N$13  (via drill 0.3)
  Top 0.25: U4.13 74.85,13.25 74.3,13.8 74.3,14.95 v73.7,15.55
  Bottom 0.25: Q3.4 v73.7,15.55
N$14
  Top 0.2: R22.1 78.55,19.2 R23.3
N$15  (via drill 0.3)
  Top 0.2: U4.8 C16.1 R22.2 81.25,19.85 80.6,20.5 v79.5,20.5 79.5,21 78.5,22 R18.2
  Bottom 0.2: v79.5,20.5 77.6,20.5 R21.1
N$16
  Top 0.25: U4.14 78.05,12.75 77.5,12.2 R16.2
N$17
  Top 0.2: R1.1 85.64,25.81 CN1.4 89.69,27.5 CN2.2
N$18
  pour Bottom (isolate 0.25, no thermals): 18.5,26.6 18.5,29.5 19.3,30.3 19.3,36.3 20.4,37.4 31.7,37.4 31.7,26.6
  pour Top (isolate 0.25, no thermals): 18,26.6 18,34 21.4,37.4 31.7,37.4 31.7,26.6
N$19  (via drill 0.3)
  other vias: 26.5,23 27.5,23 27.5,22 27.5,21 27.5,20 27.5,19 27.5,18 27.5,17 27.5,16 26.5,22 26.5,21 26.5,20 26.5,19 26.5,18 26.5,17 26.5,16
  pour Top (isolate 0.25, no thermals): 18,24.5 18,15.5 28,15.5 28,23.3 22.9,23.3 22.9,24.5
  pour Bottom (isolate 0.25, no thermals): 18,24.5 18,15.5 28,15.5 28,24.5
N$20
  pour Bottom (isolate 0.25, rank 2, no thermals): 18.5,13.4 18.5,10.5 19.3,9.7 19.3,3.7 20.4,2.6 31.7,2.6 31.7,13.4
  pour Top (isolate 0.25, no thermals): 18,13.4 18,6 21.4,2.6 31.7,2.6 31.7,13.4
N$21
  Top 0.2: R30.2 R29.1
N$22
  pour Bottom (isolate 0.25, no thermals): 52,25 52,22.4 59,22.4 59,25
N$23  (via drill 0.3)
  Top 0.5: Q6.1 v38.17,32 | R37.2 v44.1,33.8
  Bottom 0.5: v38.17,32 41,32 42.8,33.8 v44.1,33.8
N$24  (via drill 0.3)
  Top 0.5: R38.2 v44.1,35.4
  Bottom 0.5: Q7.1 41.04,34.54 41.9,35.4 v44.1,35.4
N$25  (via drill 0.3)
  Top 0.2: R38.1 47.5,35.4 v47.9,35
  Top 0.4: U6.5 47.23,33.48 R37.1
  Top 0.5: R38.1 R37.1
  Bottom 0.2: R35.2 v47.9,35
N$26
  Top 0.5: Q8.1 41.46,5.46 44.3,8.3 44.3,28.4 45.1,29.2 R39.2
N$27  (via drill 0.3)
  Top 0.5: v38.17,8 43,8 43.6,8.6 43.6,31.5 44.3,32.2 R40.2
  Bottom 0.5: Q9.1 v38.17,8
N$28  (via drill 0.3)
  Top 0.2: v47.9,30.6 R39.1
  Top 0.4: U6.7 46.92,32.17 R40.1
  Top 0.5: R40.1 R39.1
  Bottom 0.2: R36.2 v47.9,30.6
N$29
  Bottom 0.2: R21.2 R20.1
N$30  (via drill 0.3)
  Top 0.2: Q4.3 51.9,27.3 51.1,26.5 R31.1 50.2,24.9 v49.3,24
  Bottom 0.2: Q5.1 v49.3,24
N$31
  pour Bottom (isolate 0.25, no thermals): 68.5,7.7 70.8,7.7 70.8,6.3 68.5,6.3
N$32
  Top 0.2: Q4.1 R28.2
N$33
  Top 0.2: R30.1 D7.A
N$34
  Top 0.2: R2.1 86.05,22.45 86.87,23.27 CN1.3 89.77,21.5 CN2.4
N$35
  Top 0.2: D3.A R7.1
N$36  (via drill 0.3)
  Top 0.2: R26.2B 30.23,24.23 v30.4,24.4
  Bottom 0.2: U5.4 51.55,36.45 50.8,37.2 35,37.2 33.8,36 33.8,26 32.8,25 31,25 v30.4,24.4
N$37  (via drill 0.3)
  Top 0.2: R26.1B 31.57,24.23 v31.4,24.4
  Bottom 0.2: v31.4,24.4 32.8,24.4 34.2,25.8 34.2,35.8 35.2,36.8 48.45,36.8 48.8,36.45 U5.3
N$38
  Bottom 0.2: D1.A 93,24 92.5,24.5 CN2.3
N$39
  Top 0.2: D4.A R8.1
N$40  (via drill 0.3)
  Top 0.2: U3.25 68.4,29.7 68.2,29.9 v68.2,30.5 | R8.2 87.2,37.5 86.5,38.2 v85.9,38.2
  Bottom 0.2: v68.2,30.5 68.2,35.4 71.2,38.4 85.7,38.4 v85.9,38.2
N$41  (via drill 0.3)
  Top 0.2: R7.2 v90.3,37.5 | U3.27 v67.6,31.3
  Bottom 0.2: v90.3,37.5 87.5,37.5 86.2,38.8 71,38.8 67.6,35.4 v67.6,31.3
VBAT  (via drill 0.3)
  Top 0.2: R13.2 v78.8,8.5 | R11.1 R10.1 86.65,9.45 86.4,9.2 v82.7,9.2
  Top 0.6: v98,21 98,30 96,32 86.5,32 | 86.5,32 v86.5,30.25 | 86.5,32 v86.5,37.25
  Bottom 0.2: v78.8,8.5 78.8,7 | v82.7,9.2 82.5,9 82.5,7.5 82,7
  Bottom 0.6: U1.1 83.05,30.25 C1.1 v86.5,30.25 | U2.1 83.05,37.25 C2.1 v86.5,37.25 | 93.3,4 93.3,6.7 98,6.7 v98,21
  pour Bottom (isolate 0.25, rank 3, no thermals): 63,10 arc90 62,9 62,0.5 93.5,0.5 93.5,4 82,4 82,7 68.5,7 68.5,10
VCAP  (via drill 0.6)
  Top 0.2: R29.2 15.6,33.5
  Top 1: v47,12 47,6 43,2
  Bottom 0.2: R20.2 64,21 62,19 D6.K
  Bottom 0.5: R32.3 57.23,16.18 D5.K
  Bottom 1: v47,12 54.3,12 56.4,14.1 C17.1
  other vias: 34.5,1.5
  pour Bottom (isolate 0.25, no thermals): 56,18 56,13.7 59.2,13.7 59.2,16.6 62.7,16.6 62.7,18
  pour Bottom (isolate 0.25, no thermals): 0.5,33.5 0.5,6.5 6.5,6.5 6.5,0.4 36,0.4 36,2 34,2 33,1 20,1 18.3,2.7 18.3,8.7 16,11 16,29 18.3,31.3 18.3,36.6 6.5,36.6 6.5,33.5
  pour Top (isolate 0.25, no thermals): 0.5,33.5 0.5,6.5 6.5,6.5 6.5,0.5 42.1,0.5 44.1,2.5 34.5,2.5 33,1 20,1 16,5 16,33.5